# Altium project Emergency Button v2_0.PrjPcb
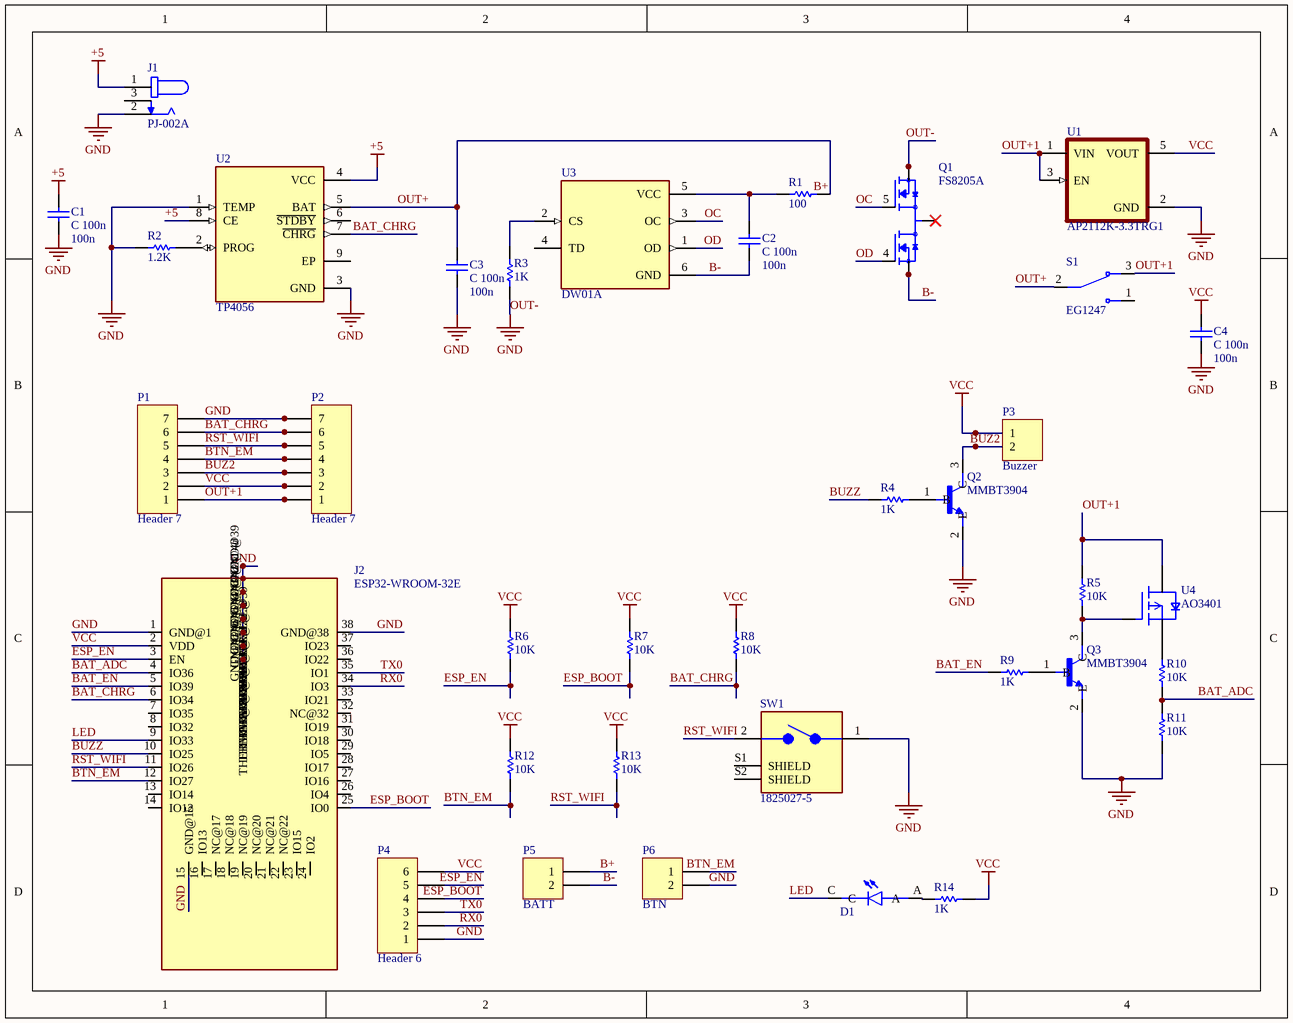
[diagram p0: Emergency_Button_v2_0.SchDoc]
1 sheet, 36 parts. Net scope: global (net labels, ports and power ports of the same name join across sheets).
Board file: Emergency_Button_v2_0.PcbDoc

## Sheet Emergency_Button_v2_0.SchDoc
size A

### Parts
C1  C 100n  value 100n  [6-0805_N]
C2  C 100n  value 100n  [6-0805_N]
C3  C 100n  value 100n  [6-0805_N]
C4  C 100n  value 100n  [6-0805_N]
D1  LED 0805  [LEDC2012X70N]  (value not drawn)
J1  PJ-002A  [CUI_PJ-002A]
J2  ESP32-WROOM-32E  [ESP32-WROOM-32E]
P1  Header 7  [HDR1X7]
P2  Header 7  [HDR1X7]
P3  Buzzer  [HDR1X2]
P4  Header 6  [HDR1X6]
P5  BATT  [HDR1X2]
P6  BTN  [JST_B2B-XH-A(LF)(SN)]
Q1  FS8205A  [SOP65P640X120-8N]
Q2  MMBT3904  [SOT95P240X120-3N]
Q3  MMBT3904  [SOT95P240X120-3N]
R1  value 100  [6-0805_N]  (hidden comment: R 100)
R2  value 1.2K  [6-0805_N]  (hidden comment: R 1.2K)
R3  value 1K  [6-0805_N]  (hidden comment: R 1K)
R4  value 1K  [6-0805_N]  (hidden comment: R 1K)
R5  value 10K  [6-0805_N]  (hidden comment: R 10K)
R6  value 10K  [6-0805_N]  (hidden comment: R 10K)
R7  value 10K  [6-0805_N]  (hidden comment: R 10K)
R8  value 10K  [6-0805_N]  (hidden comment: R 10K)
R9  value 1K  [6-0805_N]  (hidden comment: R 1K)
R10  value 10K  [6-0805_N]  (hidden comment: R 10K)
R11  value 10K  [6-0805_N]  (hidden comment: R 10K)
R12  value 10K  [6-0805_N]  (hidden comment: R 10K)
R13  value 10K  [6-0805_N]  (hidden comment: R 10K)
R14  value 1K  [6-0805_N]  (hidden comment: R 1K)
S1  EG1247  [SW_EG1247]
SW1  1825027-5  [SW_1825027-5]
U1  AP2112K-3.3TRG1  [SOT95P285X140-5N]
U2  TP4056  [SOP127P600X175-9N]
U3  DW01A  [SOT95P280X145-6N]
U4  AO3401  [SOT-23_N]

### Nets
+5: C1.2 J1.1 U2.4(VCC) U2.8(CE)
GND: C1.1 C3.1 C4.1 J1.2 J2.1(GND@1) J2.15(GND@15) J2.38(GND@38) J2.GND@39(THERMAL@39) J2.GND@40(THERMAL@39) J2.GND@41(THERMAL@39) J2.GND@42(THERMAL@39) J2.GND@43(THERMAL@39) J2.GND@44(THERMAL@39) J2.GND@45(THERMAL@39) J2.GND@46(THERMAL@39) J2.GND@47(THERMAL@39) P1.7 P2.7 P4.1 P6.2 Q1.6(S2) Q1.7(S2) Q2.2(E) Q3.2(E) R2.2 R3.2 R11.1 SW1.1 U1.2(GND) U2.1(TEMP) U2.3(GND)  [also labelled OUT-]
VCC: C4.2 J2.2(VDD) P1.2 P2.2 P3.1 P4.6 R6.2 R7.2 R8.2 R12.2 R13.2 R14.2 U1.5(VOUT)
B+: C3.2 P5.1 R1.2 S1.2 U2.5(BAT)  [also labelled OUT+]
B-: C2.1 P5.2 Q1.2(S1) Q1.3(S1) U3.6(GND)
BAT_ADC: J2.4(IO36) R10.1 R11.2
BAT_CHRG: J2.6(IO34) P1.6 P2.6 R8.1 U2.7(~{CHRG})
BAT_EN: J2.5(IO39) R9.1
BTN_EM: J2.12(IO27) P1.4 P2.4 P6.1 R12.1
BUZ2: P1.3 P2.3 P3.2 Q2.3(C)
BUZZ: J2.10(IO25) R4.1
ESP_BOOT: J2.25(IO0) P4.4 R7.1
ESP_EN: J2.3(EN) P4.5 R6.1
LED: D1.C J2.9(IO33)
OC: Q1.5(G2) U3.3(OC)
OD: Q1.4(G1) U3.1(OD)
OUT+1: P1.1 P2.1 R5.2 S1.3 U1.1(VIN) U1.3(EN) U4.3(D)
RST_WIFI: J2.11(IO26) P1.5 P2.5 R13.1 SW1.2
RX0: J2.34(IO3) P4.2
TX0: J2.35(IO1) P4.3
NetC2_2: C2.2 R1.1 U3.5(VCC)
NetD1_A: D1.A R14.1
NetQ1_1: Q1.1(D12) Q1.8(D12)
NetQ2_1: Q2.1(B) R4.2
NetQ3_1: Q3.1(B) R9.2
NetQ3_3: Q3.3(C) R5.1 U4.1(G)
NetR2_1: R2.1 U2.2(PROG)
NetR3_1: R3.1 U3.2(CS)
NetR10_2: R10.2 U4.2(S)

Not connected (* = marked no-connect by the designer): J1 3; J2 7(IO35) 8(IO32) 13(IO14) 14(IO12) 16(IO13) 17(NC@17) 18(NC@18) 19(NC@19) 20(NC@20) 21(NC@21) 22(NC@22) 23(IO15) 24(IO2) 26(IO4) 27(IO16) 28(IO17) 29(IO5) 30(IO18) 31(IO19) 32(NC@32) 33(IO21) 36(IO22) 37(IO23); S1 1; SW1 S1(SHIELD) S2(SHIELD); U2 6(~{STDBY}) 9(EP); U3 4(TD)

### Library data of the parts
C1-C4 = Cap: Capacitor; Published: 8-Jun-2000; LatestRevisionDate: 17-Jul-2002; LatestRevisionNote: Re-released for DXP Platform.; PackageReference: RAD-0.3; Publisher: Altium Limited; PackageDescription: Radial Cap, Thru-Hole; 2 Leads; 0.3 in Pin Spacing
D1 = 597-3305-607F: LED Uni-Color Green 4-Pin Chip 0805 T/R; Availability: Unavailable; Value: *; Price: None; MP: 597-3305-607F; Package: None
J1 = PJ-002A: 2.0 x 6.5 mm, 2.5 A, Horizontal, Through Hole, Dc Power Jack Connector; MF: CUI Devices; MP: PJ-002A; Check_prices: https://www.snapeda.com/parts/PJ-002A/CUI+Devices/view-part/?ref=eda; Availability: In Stock; CUI_purchase_URL: https://www.cuidevices.com/product/interconnect/connectors/dc-power-connectors/jacks/pj-002a?utm_source=snapeda.com&utm_medium=referral&utm_campaign=snapedaBOM; SnapEDA_Link: https://www.snapeda.com/parts/PJ-002A/CUI+Devices/view-part/?ref=snap; Purchase-URL: https://pricing.snapeda.com/search/part/PJ-002A/?ref=eda; Price: None; Package: None; Value: *
J2 = ESP32-WROOM-32E: RX TXRX MOD WIFI TRACE ANT SMD; MF: Espressif Systems; Package: SMD-44 Espressif Systems; Price: None; Value: *; SnapEDA_Link: https://www.snapeda.com/parts/ESP32-WROOM-32E/Espressif+Systems/view-part/?ref=snap; MP: ESP32-WROOM-32E; Availability: In Stock; Check_prices: https://www.snapeda.com/parts/ESP32-WROOM-32E/Espressif+Systems/view-part/?ref=eda
P1 P2 = Header 7: Header, 7-Pin; LatestRevisionDate: 17-Jul-2002; LatestRevisionNote: Re-released for DXP Platform.; Publisher: Altium Limited
P3 P5 P6 = Header 2: Header, 2-Pin; LatestRevisionDate: 17-Jul-2002; LatestRevisionNote: Re-released for DXP Platform.; Publisher: Altium Limited
P4 = Header 6: Header, 6-Pin; LatestRevisionDate: 17-Jul-2002; LatestRevisionNote: Re-released for DXP Platform.; Publisher: Altium Limited
Q1 = FS8205A: N/A; MF: Fortune Semiconductor; MP: FS8205A; Value: *; Availability: Not in stock; Package: Package; Price: None; SnapEDA_Link: https://www.snapeda.com/parts/FS8205A/Fortune+Semiconductor/view-part/?ref=snap; Check_prices: https://www.snapeda.com/parts/FS8205A/Fortune+Semiconductor/view-part/?ref=eda
Q2 Q3 = MMBT3904: Bipolar _BJT_ Transistor NPN 40V 200mA 270MHz 350mW Surface Mount SOT-23-3; MF: STMicroelectronics; Price: None; Package: SOT-23-3 Taiwan Semiconductor; Value: *; MP: MMBT3904; Availability: Unavailable; SnapEDA_Link: https://www.snapeda.com/parts/MMBT3904/STMicroelectronics/view-part/2875870/?ref=snap
R1-R14 = Res1: Resistor; Published: 8-Jun-2000; LatestRevisionDate: 17-Jul-2002; LatestRevisionNote: Re-released for DXP Platform.; PackageReference: AXIAL-0.3; Publisher: Altium Limited; PackageDescription: Axial Device, Thru-Hole; 2 Leads; 0.3 in Pin Spacing
S1 = EG1247: Slide Switch SPDT Through Hole, Right Angle; MF: E-Switch; Availability: In Stock; Value: *; Price: None; Check_prices: https://www.snapeda.com/parts/EG1247/E-Switch/view-part/?ref=eda; Purchase-URL: https://pricing.snapeda.com/search/part/EG1247/?ref=eda; SnapEDA_Link: https://www.snapeda.com/parts/EG1247/E-Switch/view-part/?ref=snap; MP: EG1247; Package: None
SW1 = 1825027-5: Switch Tactile OFF (ON) SPST Round Button PC Pins 0.05A 24VDC 1.57N Thru-Hole Loose Piece; MF: TE Connectivity; SnapEDA_Link: https://www.snapeda.com/parts/1825027-5/TE+Connectivity+ALCOSWITCH+Switches/view-part/?ref=snap; Package: None; MP: 1825027-5; Check_prices: https://www.snapeda.com/parts/1825027-5/TE+Connectivity+ALCOSWITCH+Switches/view-part/?ref=eda; Purchase-URL: https://pricing.snapeda.com/search/part/1825027-5/?ref=eda; Digi-Key_Part_Number: 450-1662-ND; EU_RoHS_Compliance: Compliant; Value: *
U1 = AP2112K-3.3TRG1: Linear Voltage Regulator IC Positive Fixed 1 Output 600mA SOT-25; MF: Diodes Inc.; Value: *; Purchase-URL: https://pricing.snapeda.com/search/part/AP2112K-3.3TRG1/?ref=eda; Package: SOT-753 Diodes Inc.; Availability: In Stock; Check_prices: https://www.snapeda.com/parts/AP2112K-3.3TRG1/Diodes+Inc./view-part/?ref=eda; Price: None; SnapEDA_Link: https://www.snapeda.com/parts/AP2112K-3.3TRG1/Diodes+Inc./view-part/?ref=snap; MP: AP2112K-3.3TRG1
U2 = TP4056: Complete single cell Li-Ion battery with a constant current / constant voltage linear charger; MF: NanJing Top Power ASIC Corp.; Check_prices: https://www.snapeda.com/parts/TP4056/NanJing+Top+Power+ASIC+Corp./view-part/?ref=eda; SnapEDA_Link: https://www.snapeda.com/parts/TP4056/NanJing+Top+Power+ASIC+Corp./view-part/?ref=snap; Price: None; Availability: Not in stock; Package: Package; MP: TP4056; Value: *
U3 = DW01A: One Cell Lithium-ion/Polymer Battery Protection IC; MF: Fortune Semiconductor; SnapEDA_Link: https://www.snapeda.com/parts/DW01A/Fortune+Semiconductor/view-part/?ref=snap; Package: SOT-23-6 Fortune Semiconductor; Value: *; MP: DW01A; Check_prices: https://www.snapeda.com/parts/DW01A/Fortune+Semiconductor/view-part/?ref=eda
U4 = AO3401: P-Channel 30V 4A (Ta) 1.4W (Ta) Surface Mount SOT-23-3L; MF: Alpha & Omega Semiconductor; Price: None; SnapEDA_Link: https://www.snapeda.com/parts/AO3401/Alpha%20&%20Omega%20Semiconductor/view-part/4795619/?ref=snap; Arrow_Electronics-Purchase-URL: https://snapeda.com/shop?store=Arrow+Electronics&id=4795619; Availability: Warning; MP: AO3401; Value: *; Package: SOT-23-3 Alpha &amp; Omega Semiconductor; BuyPart: https://www.snapeda.com/parts/AO3401/Alpha%20&%20Omega%20Semiconductor/view-part/4795619/?ref=eda